# Altium schematic sheet 512KBits_I2C_EEPROM.SchDoc: 512KBits I2C EEPROM
size A4
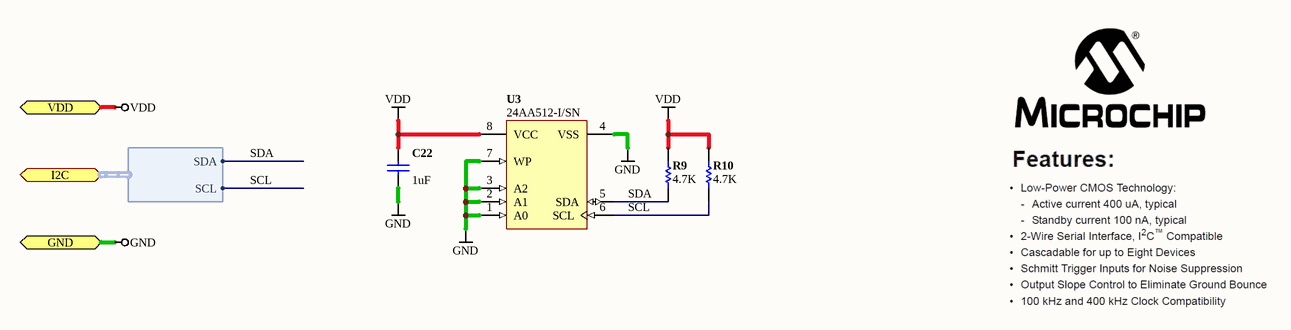
[diagram p0: 512KBits_I2C_EEPROM.SchDoc]

## Parts
C22  value 1uF  [CAPC0402(1005)60_N]  (hidden comment: CAP 1uF 6.3V 0402(1005))
R9  value 4.7K  [RESC0402(1005)_N]  (hidden comment: 4K7 5% 0402(1005))
R10  value 4.7K  [RESC0402(1005)_N]  (hidden comment: 4K7 5% 0402(1005))
U3  24AA512-I/SN  [MCHP-SOIC-SN8_N]

## Ports
GND, I2C (harness I2C), VDD

## Harnesses
I2C: SCL, SDA

## Nets
GND: C22.1 U3.1(A0) U3.2(A1) U3.3(A2) U3.4(VSS) U3.7(WP) ; port GND
VDD: C22.2 R9.2 R10.2 U3.8(VCC) ; port VDD
SCL: R10.1 U3.6(SCL) ; port I2C.SCL
SDA: R9.1 U3.5(SDA) ; port I2C.SDA

## Notes on the sheet
- Sheet Title
- Project Title
- Size:
- Date:
- A4
- Item:
- Time:
- Revision:
- Sheet
- of
- File:

## Library data of the parts
C22 = CMP-1034-02113-1: CAP 1uF 6.3V ±10% 0402 (1005 Metric) Thickness 0.6mm SMD; Case-Metric: 1005; Case-EIA: 0402; Technology: SMT; Tolerance: ±10%; Rated Voltage: 6.3 V; Max Thickness: 0.6 mm
R9 R10 = CMP-1011-00090-1: 4K7 0.063W 5% 0402 (1005 Metric)  SMD; Case-EIA: 0402; Case-Metric: 1005; Tolerance: 5 %; Power: 0.063 W; Technology: SMT
U3 = CMP-0159-01018-1: 512K bits I2C™ Serial EEPROM, 1.7 to 5.5 V, 400 kHz, -40 to 85 degC, 8-pin SOIC (SN8), Tube; Manufacturer: Microchip; PackageDescription: 8-Lead Plastic Small Outline, 4.9 x 3.9 mm Body, 1.27 mm Pitch; ComponentLink4Description: Product URL; ComponentLink1URL: http://www.microchip.com; ComponentLink2Description: Datasheet; ComponentLink3URL: http://www.microchip.com/stellent/groups/techpub_sg/documents/packagingspec/en012702.pdf; ComponentLink1Description: Manufacturer URL; ComponentLink4URL: http://www.microchip.com/24AA512; PackageReference: SOIC-SN8; Mounting Technology: Surface Mount; DatasheetVersion: Rev. M; ComponentLink3Description: Package Specification; ComponentLink2URL: http://ww1.microchip.com/downloads/en/DeviceDoc/21754M.pdf; PartNumber: 24AA512-I/SN; PackageVersion: C04-057C